# EAGLE design latch (EAGLE 8.3.1)
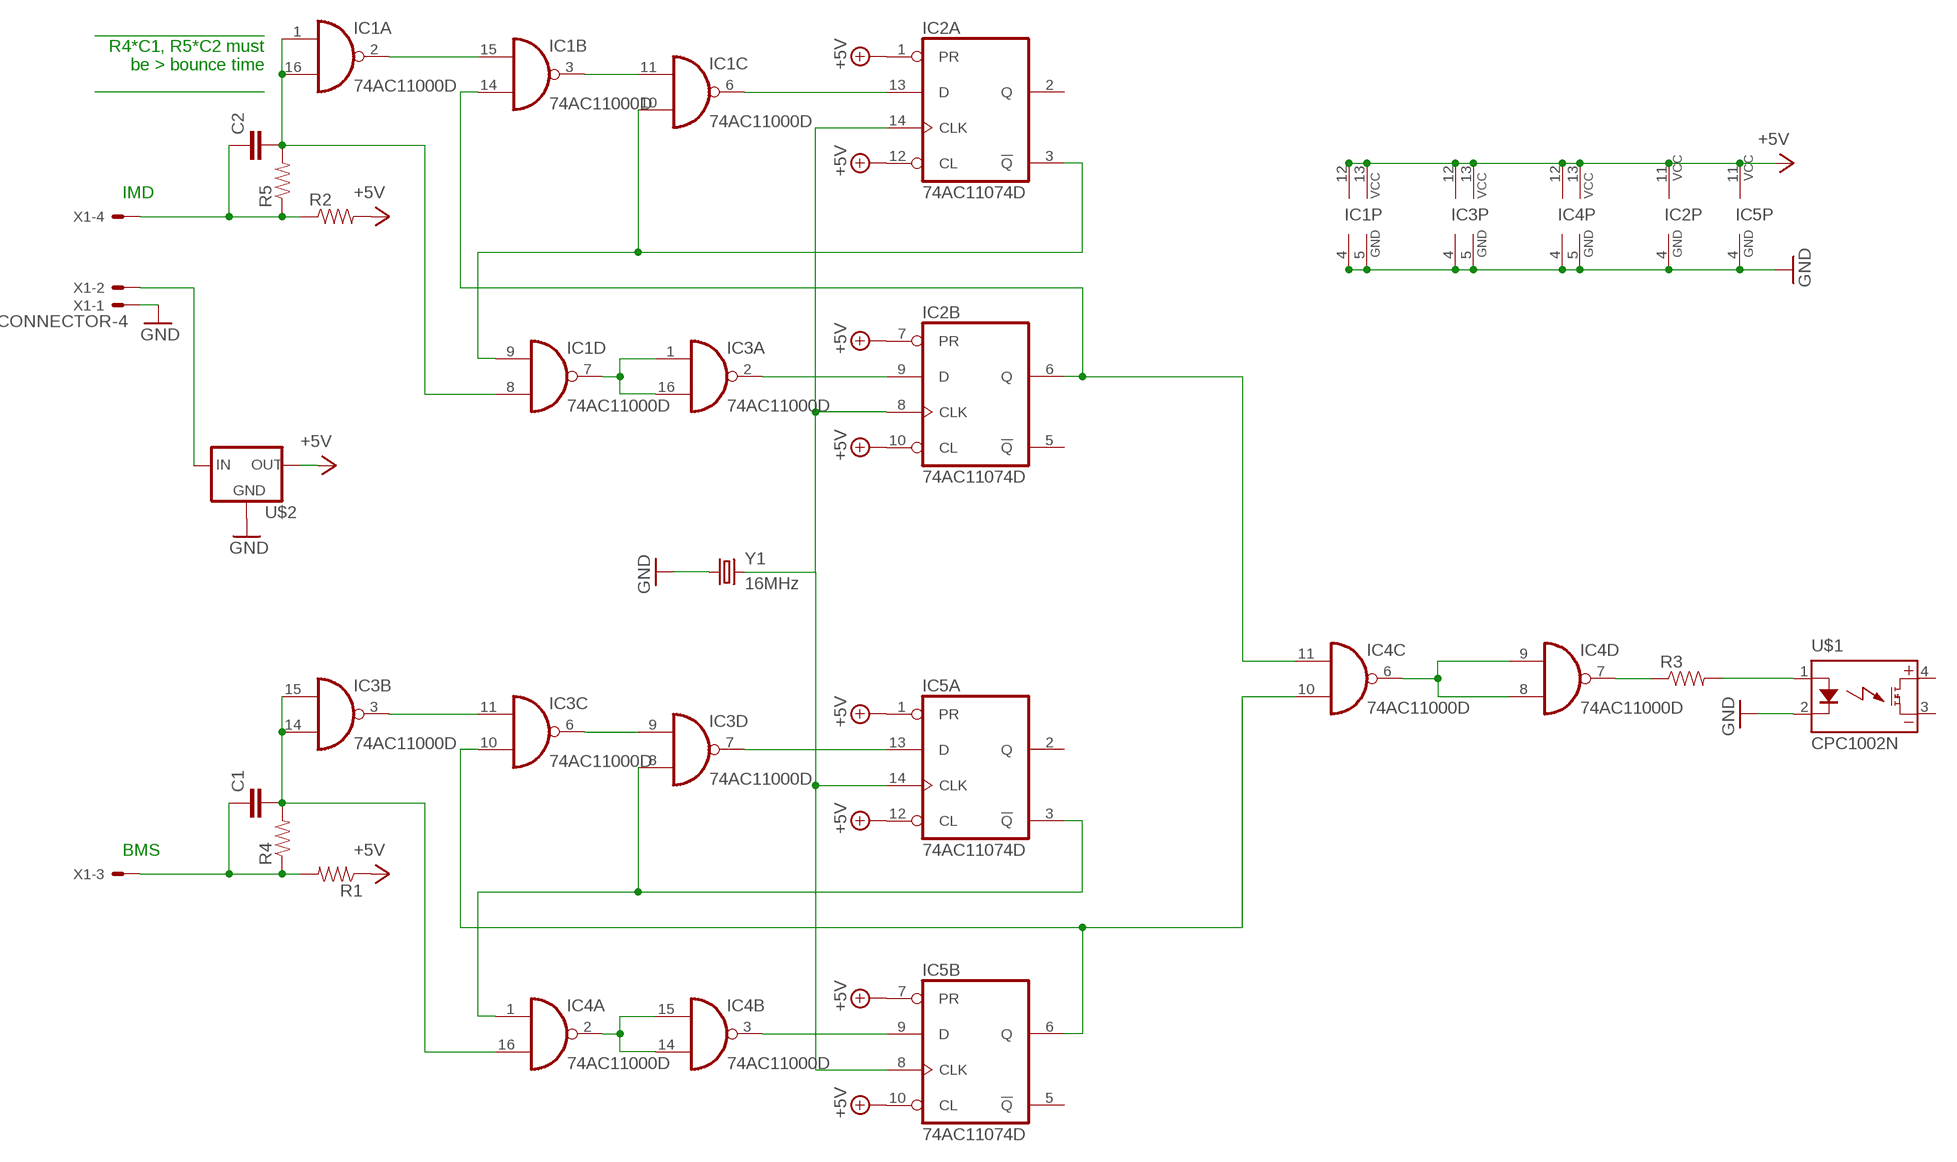
[diagram p0: schematic, sheet 1]

## Parts
C1  CAP0402-CAP  [0402-CAP]
C2  CAP0402-CAP  [0402-CAP]
IC1  74AC11000D  [SO16]
IC2  74AC11074D  [SO14]
IC3  74AC11000D  [SO16]
IC4  74AC11000D  [SO16]
IC5  74AC11074D  [SO14]
R1  RESISTOR0402  [0402-RES]
R2  RESISTOR0402  [0402-RES]
R3  RESISTOR0402  [0402-RES]
R4  RESISTOR0402  [0402-RES]
R5  RESISTOR0402  [0402-RES]
U$1  CPC1002N  [SOP04]
U$2  5VREG_LM340-NLM340MPX-5.0/NOPB  [SOT223]
X1  CONNECTOR-4  [MINIFIT_5566-4]
Y1  16MHz  CRYSTAL3.2X1.5MM  [CRYSTAL-SMD-3.2X1.5MM]

## Nets
+5V: IC1.12(P:VCC) IC1.13(P:VCC) IC2.1(A:PR) IC2.7(B:PR) IC2.10(B:CL) IC2.11(P:VCC) IC2.12(A:CL) IC3.12(P:VCC) IC3.13(P:VCC) IC4.12(P:VCC) IC4.13(P:VCC) IC5.1(A:PR) IC5.7(B:PR) IC5.10(B:CL) IC5.11(P:VCC) IC5.12(A:CL) R1.1 R2.2 U$2.3(OUT)
GND: IC1.4(P:GND) IC1.5(P:GND) IC2.4(P:GND) IC3.4(P:GND) IC3.5(P:GND) IC4.4(P:GND) IC4.5(P:GND) IC5.4(P:GND) U$1.2(CONTROL-) U$2.2(GND) U$2.4(GND) X1.1 Y1.P$1
N$1: C2.1 R2.1 R5.1 X1.4
N$2: IC1.2(A:O) IC1.15(B:I0)
N$3: C2.2 IC1.1(A:I0) IC1.8(D:I1) IC1.16(A:I1) R5.2
N$4: IC1.3(B:O) IC1.11(C:I0)
N$5: IC1.9(D:I0) IC1.10(C:I1) IC2.3(A:!Q)
N$6: IC1.6(C:O) IC2.13(A:D)
N$7: IC2.8(B:CLK) IC2.14(A:CLK) IC5.8(B:CLK) IC5.14(A:CLK) Y1.P$2
N$8: IC2.9(B:D) IC3.2(A:O)
N$9: IC1.14(B:I1) IC2.6(B:Q) IC4.11(C:I0)
N$10: IC4.3(B:O) IC5.9(B:D)
N$11: IC1.7(D:O) IC3.1(A:I0) IC3.16(A:I1)
N$12: IC4.7(D:O) R3.1
N$13: R3.2 U$1.1(CONTROL+)
N$14: C1.2 IC3.14(B:I1) IC3.15(B:I0) R4.2
N$15: C1.1 R1.2 R4.1 X1.3
N$16: U$2.1(IN) X1.2
N$19: IC4.16(A:I1)
N$20: IC3.3(B:O) IC3.11(C:I0)
N$21: IC3.6(C:O) IC3.9(D:I0)
N$22: IC3.8(D:I1) IC4.1(A:I0) IC5.3(A:!Q)
N$23: IC3.7(D:O) IC5.13(A:D)
N$24: IC3.10(C:I1) IC4.10(C:I1) IC5.6(B:Q)
N$25: IC4.2(A:O) IC4.14(B:I1) IC4.15(B:I0)
N$27: IC4.6(C:O) IC4.8(D:I1) IC4.9(D:I0)
Unconnected: IC2.2(A:Q) IC2.5(B:!Q) IC5.2(A:Q) IC5.5(B:!Q) U$1.3(DC-) U$1.4(DC+)

## Notes on the sheet
- _________________
  R4*C1, R5*C2 must
  be > bounce time
  _________________
- IMD
- BMS

## Library data of the parts
C1 C2 = HyTechDevices:CAP: Capacitor Standard 0603 ceramic capacitor, and 0.1" leaded capacitor.
IC1 IC3 IC4 = 74ac-logic:74AC11000: Quadruple 2-input NAND
IC2 IC5 = 74ac-logic:74AC11074: Dual positive edge triggered D-type FLIP FLOP
R1-R5 = HyTechDevices:RESISTOR: Resistor Basic schematic elements and footprints for 0603, 1206, and PTH resistors.
U$1 = HyTechDevices:CPC1002N: IXYS Solid State Relay .7A
U$2 = HyTechDevices:5VREG_LM340-N: Voltage Regulator 5v linear voltage regulator Datasheet <http://www.mouser.com/ProductDetail/Texas-Instruments/LM340MPX-50-NOPB/?qs=X1J7HmVL2ZGZwtTFRQ9ItA%3D%3D> MAX current out: 1.5A MAX voltage in: 35V
X1 = HyTechDevices:CONNECTOR-4: Mini-Fit Junior connector 4 pole Source: http://www.molex.com; OC_FARNELL: unknown; OC_NEWARK: unknown
Y1 = HyTechDevices:CRYSTAL: Various standard crystals. Proven footprints. Source: Sparkfun <https://github.com/sparkfun/SparkFun-Eagle-Libraries>; PROD_ID: XTAL-13062; VALUE: 32.768kHz

## Board
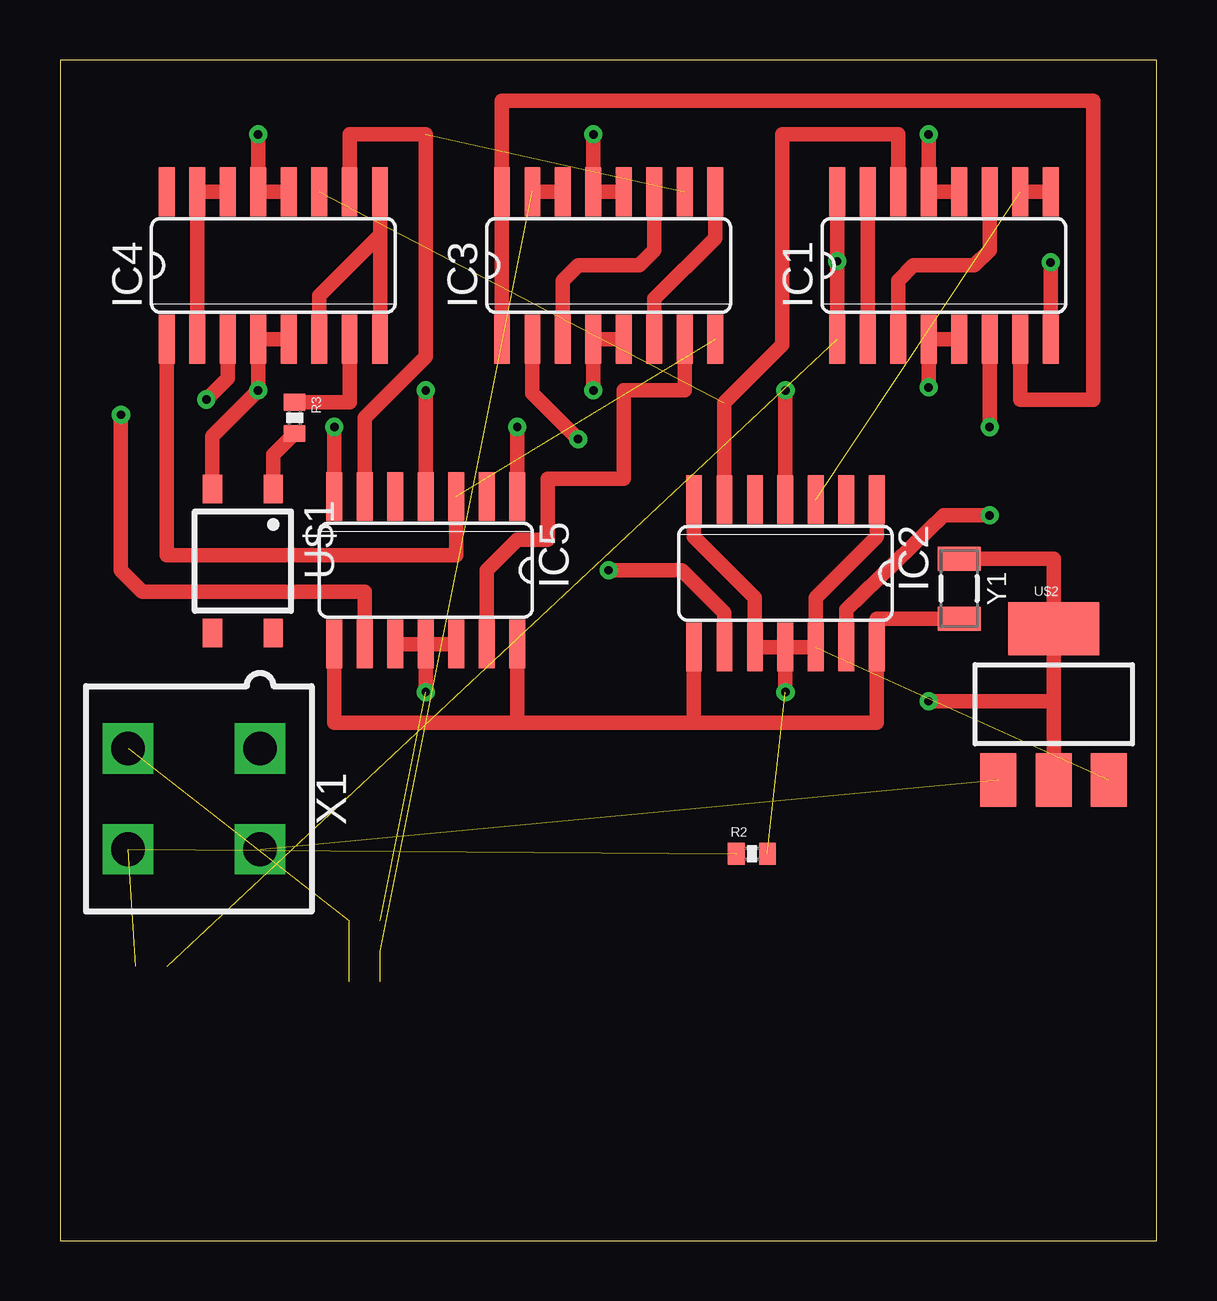
[diagram p1: board, top side]
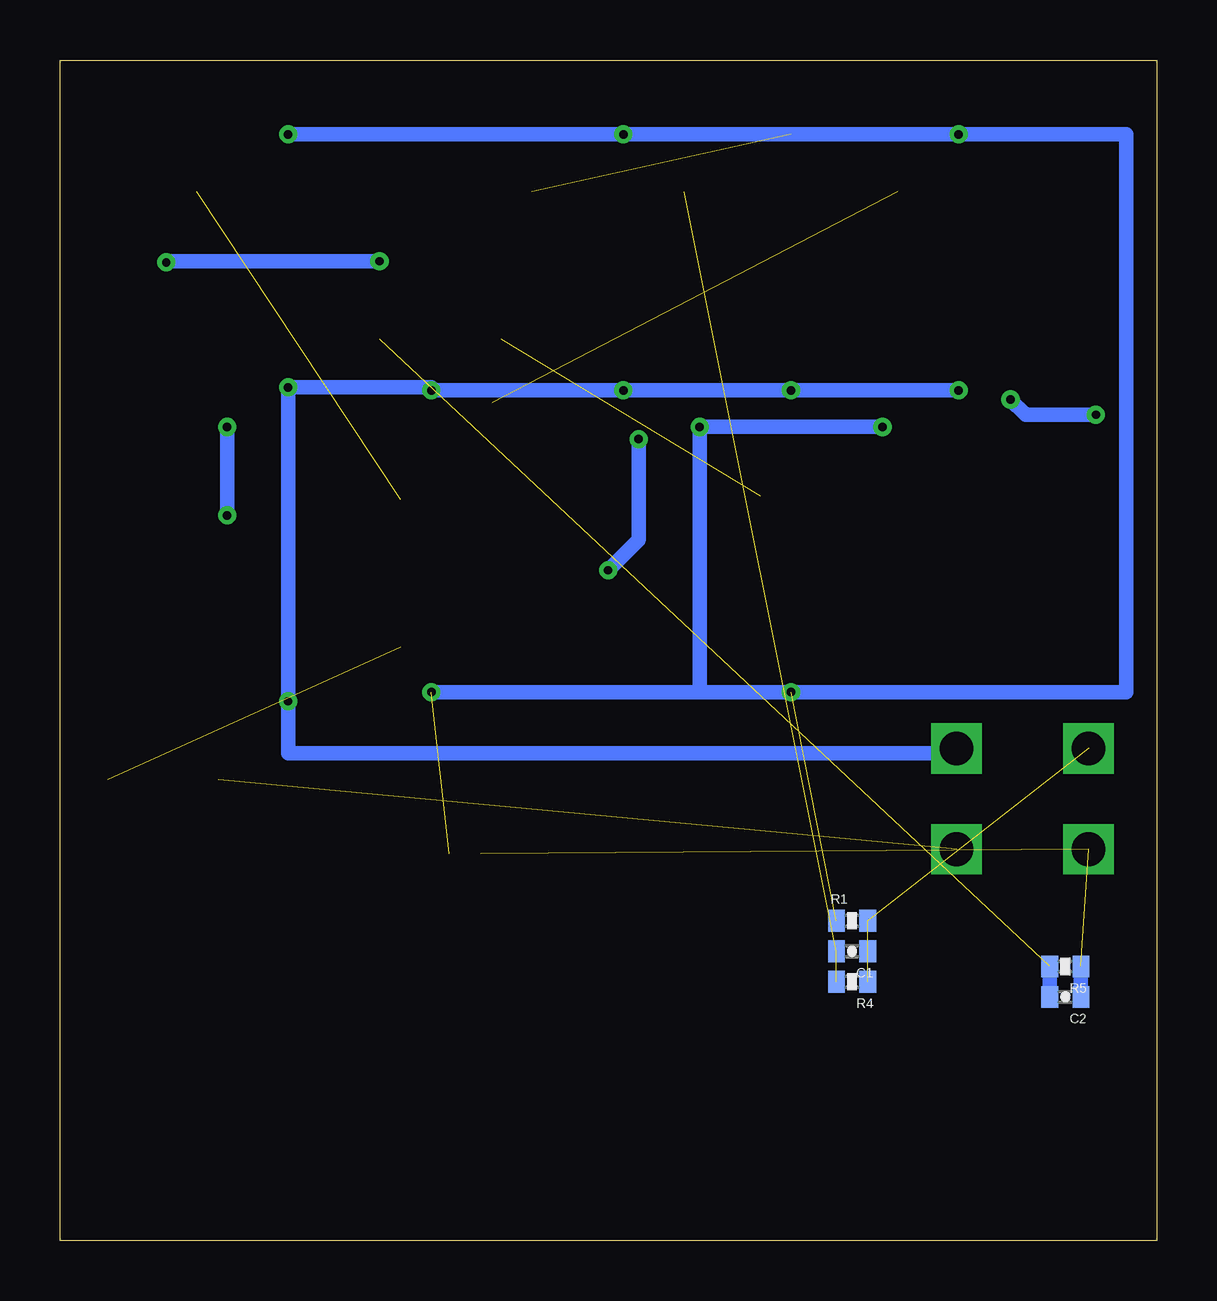
[diagram p2: board, bottom side, seen from below]

Size 45.7 x 49.2 mm. Coordinates in mm from the lower left corner, seen from the top.
Outline: 0,0 45.7,0 45.7,49.2 0,49.2 0,0
Copper layers (1*16): Top 0.035mm / dielectric 1.5mm / Bottom 0.035mm
Design rules "default": minimum track width 6mil, minimum drill 0.35mm, track to track 6mil, track to pad 6mil, pad to pad 6mil, via to via 6mil, smd to smd 6mil, copper to edge 40mil, drill to drill 6mil, minimum pad ring 10mil, minimum via ring 8mil, stop-mask expansion 4mil, vias tented up to drill 0mil, thermal gap 10mil

### Footprints (pad centres in the part's own frame; a part is rotated, then mirrored left to right if it is on the bottom)
0402-CAP = smd 0.7 x 0.9: 1 -0.65,0; 2 0.65,0
SO16 = smd 0.66 x 2.032: 1 -4.445,-3.073; 2 -3.175,-3.073; 3 -1.905,-3.073; 4 -0.635,-3.073; 5 0.635,-3.073; 6 1.905,-3.073; 7 3.175,-3.073; 8 4.445,-3.073; 9 4.445,3.073; 10 3.175,3.073; 11 1.905,3.073; 12 0.635,3.073; 13 -0.635,3.073; 14 -1.905,3.073; 15 -3.175,3.073; 16 -4.445,3.073
SO14 = smd 0.66 x 2.032: 1 -3.81,-3.073; 2 -2.54,-3.073; 3 -1.27,-3.073; 4 0,-3.073; 5 1.27,-3.073; 6 2.54,-3.073; 7 3.81,-3.073; 8 3.81,3.073; 9 2.54,3.073; 10 1.27,3.073; 11 0,3.073; 12 -1.27,3.073; 13 -2.54,3.073; 14 -3.81,3.073
0402-RES = smd 0.7 x 0.9: 1 -0.65,0; 2 0.65,0
SOP04 = smd 0.8 x 1.2: 1 -1.27,-3; 2 1.27,-3; 3 1.27,3; 4 -1.27,3
SOT223 = smd 1.5 x 2.235: 1 -2.3,-3.15; 2 0,-3.15; 3 2.3,-3.15 | smd 3.8 x 2.2: 4 0,3.15
MINIFIT_5566-4 = drill 1.4 square: 1 2.1,-2.75; 2 -2.1,-2.75; 3 2.1,2.75; 4 -2.1,2.75
CRYSTAL-SMD-3.2X1.5MM = smd 1 x 1.8: P$1 -1.25,0; P$2 1.25,0

### Placement (x,y rotation side)
C1  12.7,12.06 180 bottom
C2  3.81,10.16 180 bottom
IC1  36.83,40.64 0 top
IC2  30.23,27.81 180 top
IC3  22.86,40.64 0 top
IC4  8.89,40.64 0 top
IC5  15.24,27.94 180 top
R1  12.7,13.34 0 bottom
R2  28.83,16.13 0 top
R3  9.78,34.29 270 top
R4  12.7,10.79 180 bottom
R5  3.81,11.43 180 bottom
U$1  7.62,28.32 180 top
U$2  41.4,22.35 0 top
X1  5.59,18.41 90 top
Y1  37.47,27.18 270 top

### Tracks (layer width: path | path; a pad name or v marks a point on that pad's centre or on a via)
+5V  (via drill 0.35)  (3 unrouted)
  Top 0.61: IC4.12 IC4.13 v8.26,46.1 | IC3.12 IC3.13 v22.23,46.1 | IC1.12 IC1.13 v36.2,46.1 | IC5.10 IC5.11 | IC5.12 IC5.11 | 28.97,24.74 IC2.11 | 28.97,24.74 IC2.10 | IC2.11 IC2.12 31.5,26.8 34.04,29.34 IC2.1 | IC5.11 v15.24,22.86 | IC2.11 v30.23,22.86 | IC5.1 v19.05,33.91 | IC5.7 v11.43,33.91 | IC2.7 26.42,29.34 28.96,26.8 28.96,24.76 28.97,24.74
  Bottom 0.61: v36.2,46.1 v22.23,46.1 v8.26,46.1 1.27,46.1 1.27,22.86 v15.24,22.86 19.05,22.86 | 19.05,22.86 v30.23,22.86 | 19.05,22.86 v19.05,33.91 v11.43,33.91
GND  (via drill 0.35)
  Top 0.61: IC1.5 IC1.4 v36.2,35.56 | IC3.5 IC3.4 v22.23,35.43 | IC4.5 IC4.4 v8.26,35.43 6.35,33.53 U$1.2 | IC2.4 v30.23,35.43 | Y1.P$1 41.4,28.43 U$2.4 41.4,22.86 | U$2.2 41.4,22.86 | IC5.4 v15.24,35.43 | 41.4,22.86 41.4,22.48 v36.2,22.48
  Bottom 0.61: v8.26,35.43 v15.24,35.43 v22.23,35.43 v30.23,35.43 30.23,35.56 v36.2,35.56 v36.2,22.48 36.2,20.32 8.34,20.32 X1.1
N$1  (2 unrouted)
  Bottom 0.61: R5.1 C2.1
N$2
  Top 0.61: IC1.15 IC1.2
N$3  (via drill 0.35)  (1 unrouted)
  Top 0.61: IC1.16 v32.38,40.81 IC1.1 | IC1.8 v41.27,40.77
  Bottom 0.61: C2.2 R5.2 | v41.27,40.77 41.27,40.81 v32.38,40.81
N$4
  Top 0.61: IC1.11 38.73,41.27 38.1,40.64 35.56,40.64 34.92,40.01 IC1.3
N$5  (1 unrouted)
  Top 0.61: IC1.10 IC1.9
N$6  (via drill 0.35)
  Top 0.61: IC2.13 32.77,26.29 36.83,30.23 v38.73,30.23 | IC1.6 v38.73,33.91
  Bottom 0.61: v38.73,30.23 v38.73,33.91
N$7
  Top 0.61: IC5.8 11.43,21.59 19.05,21.59 | IC2.8 26.42,21.59 | 26.42,21.59 19.05,21.59 | 26.42,21.59 34.04,21.59 IC2.14 34.04,25.93 Y1.P$2 | IC5.14 19.05,21.59
N$8  (via drill 0.35)
  Top 0.61: IC2.9 27.69,26.16 25.91,27.94 v22.86,27.94 | v21.59,33.4 19.68,35.31 IC3.2
  Bottom 0.61: v21.59,33.4 21.59,29.21 v22.86,27.94
N$9  (1 unrouted)
  Top 0.61: IC2.6 27.69,34.92 30.1,37.34 30.1,46.1 34.92,46.1 IC1.14
N$10  (via drill 0.35)
  Top 0.61: v2.54,34.42 2.54,27.94 3.43,27.05 12.7,27.05 IC5.9 | v6.1,35.05 6.99,35.94 IC4.3
  Bottom 0.61: v2.54,34.42 5.46,34.42 v6.1,35.05
N$11
  Top 0.61: IC3.1 IC3.16 18.41,47.5 43.05,47.5 43.05,35.05 40.01,35.05 IC1.7
N$12
  Top 0.61: R3.1 12.06,34.94 IC4.7
N$13
  Top 0.61: U$1.1 8.89,32.75 R3.2
N$14  (2 unrouted)
  Top 0.61: IC3.15 IC3.14
N$15  (3 unrouted)
N$16  (1 unrouted)
N$20
  Top 0.61: IC3.3 20.95,40.01 21.59,40.64 24.13,40.64 24.77,41.27 IC3.11
N$21
  Top 0.61: IC3.6 24.77,39.24 27.3,41.78 IC3.9
N$22  (1 unrouted)
  Top 0.61: IC4.1 4.45,28.57 16.51,28.57 IC5.3
N$23
  Top 0.61: IC5.13 17.78,27.94 19.05,29.21 20.32,29.21 20.32,31.75 23.5,31.75 23.5,35.43 26.04,35.43 IC3.7
N$24  (1 unrouted)
  Top 0.61: IC5.6 12.7,34.29 15.24,36.83 15.24,46.1 12.06,46.1 IC4.10
N$25
  Top 0.61: IC4.2 IC4.15 IC4.14
N$27
  Top 0.61: IC4.6 10.79,39.37 13.34,41.91 | 13.34,41.91 IC4.9 | IC4.8 13.34,41.91